# Altium schematic sheet OutControl.SchDoc
size A4
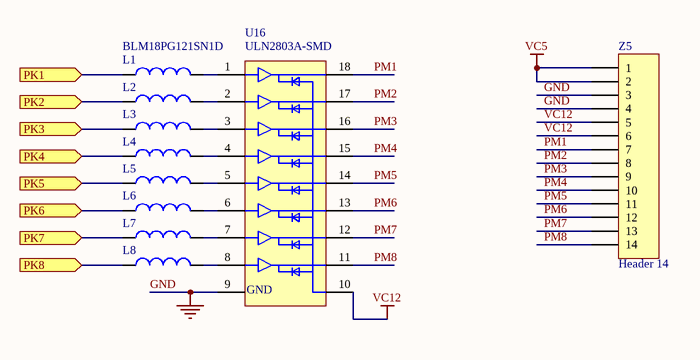
[diagram p0: OutControl.SchDoc]

## Parts
L1  BLM18PG121SN1D  [0603L]
L2  BLM18PG121SN1D  [0603L]  (value not drawn)
L3  BLM18PG121SN1D  [0603L]  (value not drawn)
L4  BLM18PG121SN1D  [0603L]  (value not drawn)
L5  BLM18PG121SN1D  [0603L]  (value not drawn)
L6  BLM18PG121SN1D  [0603L]  (value not drawn)
L7  BLM18PG121SN1D  [0603L]  (value not drawn)
L8  BLM18PG121SN1D  [0603L]  (value not drawn)
U16  ULN2803A-SMD  [SOL18]
Z5  Header 14  [UMATCH-14]

## Ports
PK1 (in), PK2 (in), PK3 (in), PK4 (in), PK5 (in), PK6 (in), PK7 (in), PK8 (in)

## Nets
GND: U16.9 Z5.3 Z5.4
VC5: Z5.1 Z5.2
VC12: U16.10 Z5.5 Z5.6
PK1: L1.1 ; port PK1
PK2: L2.1 ; port PK2
PK3: L3.1 ; port PK3
PK4: L4.1 ; port PK4
PK5: L5.1 ; port PK5
PK6: L6.1 ; port PK6
PK7: L7.1 ; port PK7
PK8: L8.1 ; port PK8
PM1: U16.18 Z5.7
PM2: U16.17 Z5.8
PM3: U16.16 Z5.9
PM4: U16.15 Z5.10
PM5: U16.14 Z5.11
PM6: U16.13 Z5.12
PM7: U16.12 Z5.13
PM8: U16.11 Z5.14
NetL1_2: L1.2 U16.1
NetL2_2: L2.2 U16.2
NetL3_2: L3.2 U16.3
NetL4_2: L4.2 U16.4
NetL5_2: L5.2 U16.5
NetL6_2: L6.2 U16.6
NetL7_2: L7.2 U16.7
NetL8_2: L8.2 U16.8

## Notes on the sheet
- (in symbol ULN2803) GND

## Library data of the parts
L1-L8 = BEAD_120R_2A_0603: Bead,120R,2A,0603,BLM18PG121SN1D,MURATA; Manuf_Part_3: FCM1608KF-601T03; Manuf_2: TDK; Manuf_Part_2: MPZ1608S300A; Manuf_3: Tai-tech; Value: 100uH; Description_3: Bead,600R,350mA,0603,FCM1608KF-601T03,Tai-tech; Description_2: Bead,30R,5A,0603,MPZ1608S300A,TDK; Revision: July-2002: Re-released for DXP Platform.; ECCN_US/EU: n/a; Manuf_Part_1: BLM18PG121SN1D; Manuf_1: MURATA
U16 = ULN2803
Z5 = Header 14: Header, 14-Pin; LatestRevisionDate: 17-Jul-2002; LatestRevisionNote: Re-released for DXP Platform.; Publisher: Altium Limited